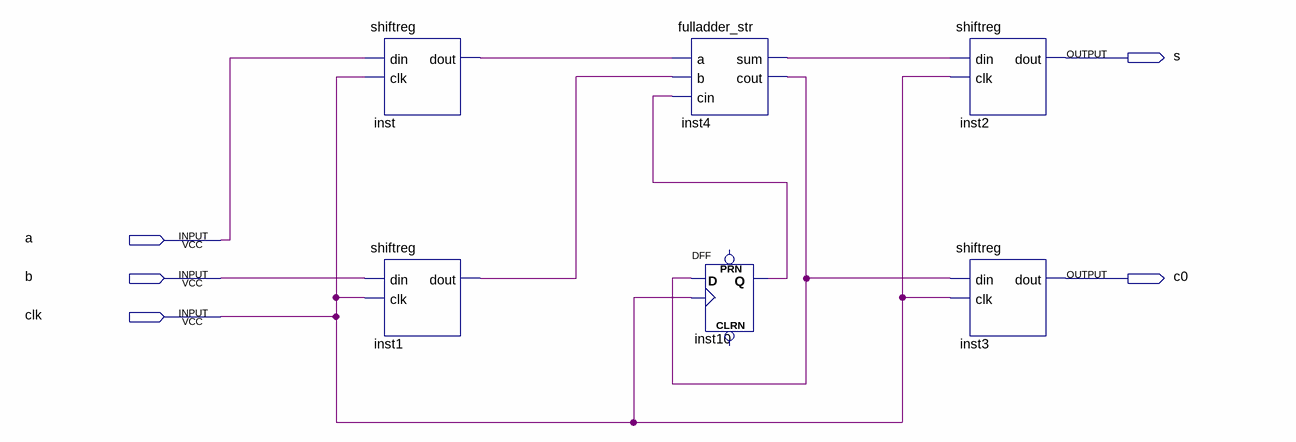
[diagram p0: schematic sheet]
// Quartus schematic seq_adder.bdf as structural Verilog: 6 symbols, 5 pins
module seq_adder (
  input  a,
  input  b,
  input  clk,
  output s,
  output c0
);

  wire inst1_dout, inst4_cout, inst4_sum, inst10_q, inst_dout;

  shiftreg inst (.din(a), .clk(clk), .dout(inst_dout));
  shiftreg inst1 (.din(b), .clk(clk), .dout(inst1_dout));
  fulladder_str inst4 (.a(inst_dout), .b(inst1_dout), .cin(inst10_q), .sum(inst4_sum), .cout(inst4_cout));
  DFF inst10 (.CLK(clk), .D(inst4_cout), .Q(inst10_q));  // open: CLRN, PRN
  shiftreg inst2 (.din(inst4_sum), .clk(clk), .dout(s));
  shiftreg inst3 (.din(inst4_cout), .clk(clk), .dout(c0));
endmodule
